# Altium project PWR_MNG.PRJPCB
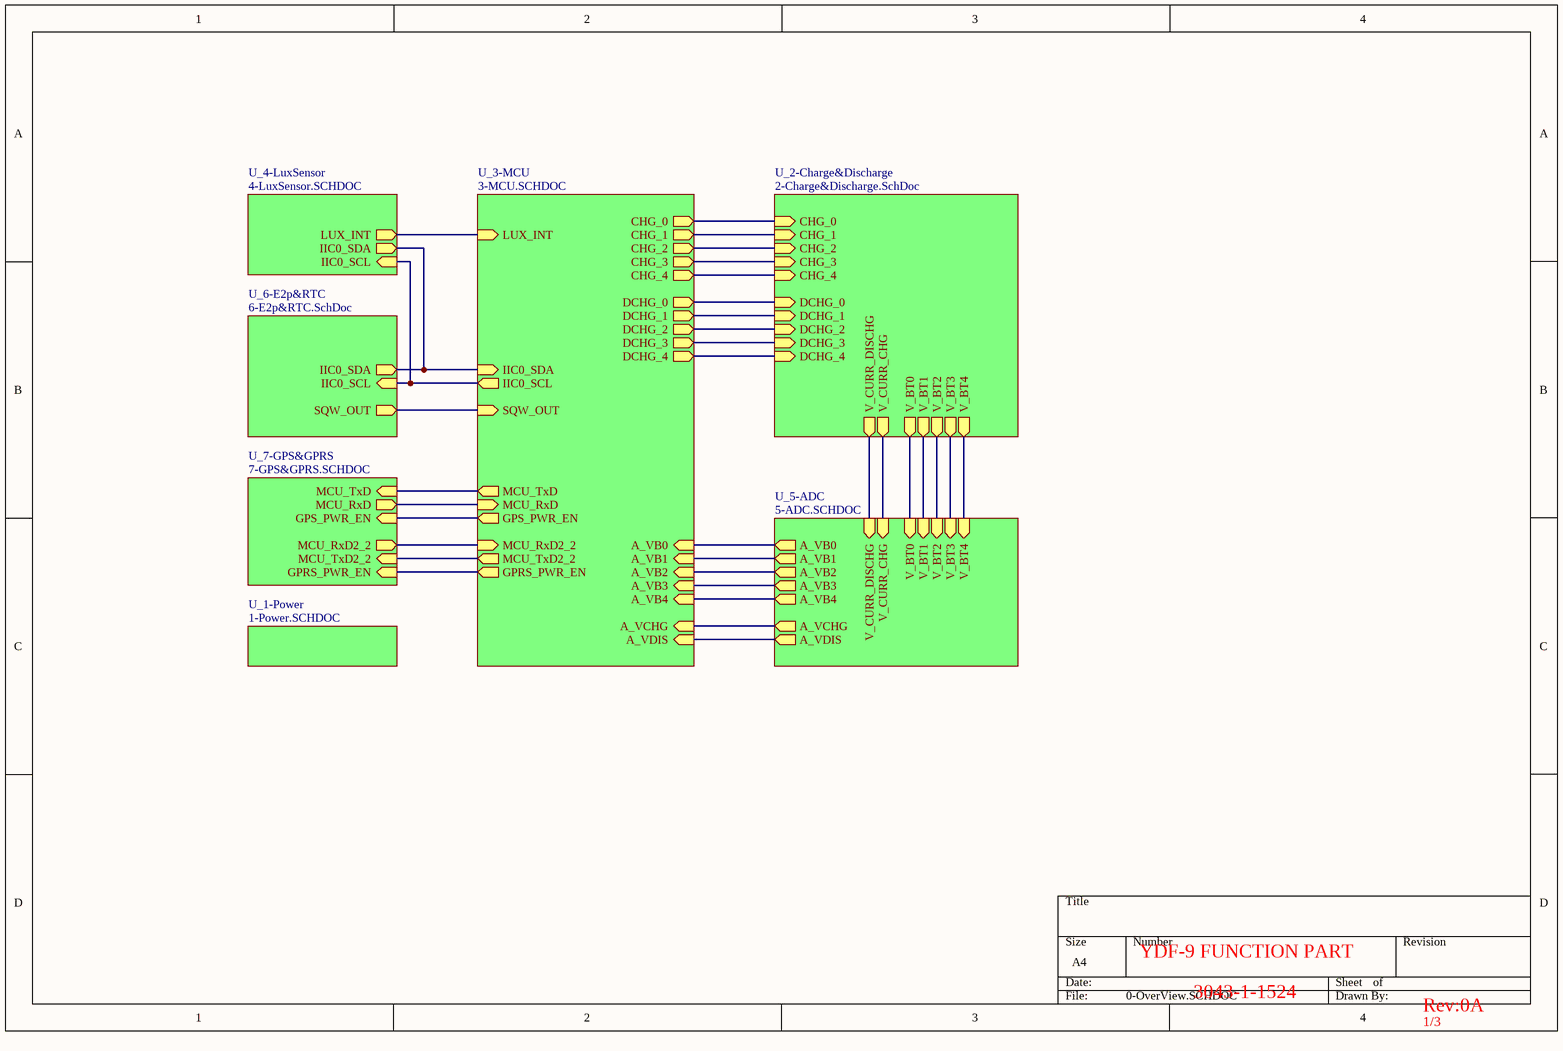
[diagram p0: 0-OverView.SCHDOC]
.TITLE: aaaaa
8 sheets, 98 parts. Net scope: hierarchical (ports join the sheet entries above them; power ports are global).
Board file: 3043-1-1532.PcbDoc
Sheets:
  0-OverView.SCHDOC
    U_2-Charge&Discharge = 2-Charge&Discharge.SchDoc
    U_1-Power = 1-Power.SCHDOC
    U_3-MCU = 3-MCU.SCHDOC
    U_5-ADC = 5-ADC.SCHDOC
    U_6-E2p&RTC = 6-E2p&RTC.SchDoc
    U_4-LuxSensor = 4-LuxSensor.SCHDOC
    U_7-GPS&GPRS = 7-GPS&GPRS.SCHDOC

## Sheet 0-OverView.SCHDOC
size A4

### Sub-sheets
U_1-Power = 1-Power.SCHDOC: no entries
U_2-Charge&Discharge = 2-Charge&Discharge.SchDoc: V_BT1 (out), V_BT2 (out), V_BT3 (out), V_BT4 (out), V_CURR_CHG (out), V_CURR_DISCHG (out), CHG_2 (in), CHG_3 (in), DCHG_0 (in), CHG_4 (in), CHG_0 (in), DCHG_1 (in), CHG_1 (in), DCHG_2 (in), DCHG_3 (in), V_BT0 (out), DCHG_4 (in)
U_3-MCU = 3-MCU.SCHDOC: IIC0_SDA (in), IIC0_SCL (out), SQW_OUT (in), A_VDIS (in), A_VCHG (in), A_VB1 (in), A_VB4 (in), A_VB2 (in), A_VB3 (in), GPRS_PWR_EN (out), MCU_RxD2_2 (in), GPS_PWR_EN (out), MCU_TxD2_2 (out), MCU_RxD (in), CHG_3 (out), CHG_4 (out), CHG_0 (out), CHG_1 (out), CHG_2 (out), DCHG_0 (out), DCHG_1 (out), DCHG_2 (out), DCHG_3 (out), LUX_INT (in), MCU_TxD (out), A_VB0 (in), DCHG_4 (out)
U_4-LuxSensor = 4-LuxSensor.SCHDOC: IIC0_SCL (in), IIC0_SDA (out), LUX_INT (out)
U_5-ADC = 5-ADC.SCHDOC: V_BT3 (in), V_BT2 (in), V_BT4 (in), V_BT1 (in), A_VDIS (out), A_VB3 (out), A_VB1 (out), A_VB4 (out), A_VCHG (out), A_VB2 (out), V_CURR_DISCHG (in), V_CURR_CHG (in), V_BT0 (in), A_VB0 (out)
U_6-E2p&RTC = 6-E2p&RTC.SchDoc: IIC0_SCL (in), IIC0_SDA (out), SQW_OUT (out)
U_7-GPS&GPRS = 7-GPS&GPRS.SCHDOC: GPS_PWR_EN (in), MCU_RxD (out), MCU_TxD2_2 (in), GPRS_PWR_EN (in), MCU_RxD2_2 (out), MCU_TxD (in)

### Nets
A_VB0: sheet U_3-MCU/A_VB0, sheet U_5-ADC/A_VB0
A_VB1: sheet U_3-MCU/A_VB1, sheet U_5-ADC/A_VB1
A_VB2: sheet U_3-MCU/A_VB2, sheet U_5-ADC/A_VB2
A_VB3: sheet U_3-MCU/A_VB3, sheet U_5-ADC/A_VB3
A_VB4: sheet U_3-MCU/A_VB4, sheet U_5-ADC/A_VB4
A_VCHG: sheet U_2-Charge&Discharge/V_CURR_CHG, sheet U_3-MCU/A_VCHG, sheet U_5-ADC/A_VCHG, sheet U_5-ADC/V_CURR_CHG
A_VDIS: sheet U_2-Charge&Discharge/V_CURR_DISCHG, sheet U_3-MCU/A_VDIS, sheet U_5-ADC/A_VDIS, sheet U_5-ADC/V_CURR_DISCHG
CHG_0: sheet U_2-Charge&Discharge/CHG_0, sheet U_3-MCU/CHG_0
CHG_1: sheet U_2-Charge&Discharge/CHG_1, sheet U_3-MCU/CHG_1
CHG_2: sheet U_2-Charge&Discharge/CHG_2, sheet U_3-MCU/CHG_2
CHG_3: sheet U_2-Charge&Discharge/CHG_3, sheet U_3-MCU/CHG_3
CHG_4: sheet U_2-Charge&Discharge/CHG_4, sheet U_3-MCU/CHG_4
DCHG_0: sheet U_2-Charge&Discharge/DCHG_0, sheet U_3-MCU/DCHG_0
DCHG_1: sheet U_2-Charge&Discharge/DCHG_1, sheet U_3-MCU/DCHG_1
DCHG_2: sheet U_2-Charge&Discharge/DCHG_2, sheet U_3-MCU/DCHG_2
DCHG_3: sheet U_2-Charge&Discharge/DCHG_3, sheet U_3-MCU/DCHG_3
DCHG_4: sheet U_2-Charge&Discharge/DCHG_4, sheet U_3-MCU/DCHG_4
GPRS_PWR_EN: sheet U_3-MCU/GPRS_PWR_EN, sheet U_7-GPS&GPRS/GPRS_PWR_EN
GPS_PWR_EN: sheet U_3-MCU/GPS_PWR_EN, sheet U_7-GPS&GPRS/GPS_PWR_EN
IIC0_SCL: sheet U_3-MCU/IIC0_SCL, sheet U_6-E2p&RTC/IIC0_SCL, sheet U_4-LuxSensor/IIC0_SCL
IIC0_SDA: sheet U_3-MCU/IIC0_SDA, sheet U_6-E2p&RTC/IIC0_SDA, sheet U_4-LuxSensor/IIC0_SDA
LUX_INT: sheet U_3-MCU/LUX_INT, sheet U_4-LuxSensor/LUX_INT
MCU_RxD: sheet U_3-MCU/MCU_RxD, sheet U_7-GPS&GPRS/MCU_RxD
MCU_RxD2_2: sheet U_3-MCU/MCU_RxD2_2, sheet U_7-GPS&GPRS/MCU_RxD2_2
MCU_TxD: sheet U_3-MCU/MCU_TxD, sheet U_7-GPS&GPRS/MCU_TxD
MCU_TxD2_2: sheet U_3-MCU/MCU_TxD2_2, sheet U_7-GPS&GPRS/MCU_TxD2_2
SQW_OUT: sheet U_3-MCU/SQW_OUT, sheet U_6-E2p&RTC/SQW_OUT
V_BT0: sheet U_2-Charge&Discharge/V_BT0, sheet U_5-ADC/V_BT0
V_BT1: sheet U_2-Charge&Discharge/V_BT1, sheet U_5-ADC/V_BT1
V_BT2: sheet U_2-Charge&Discharge/V_BT2, sheet U_5-ADC/V_BT2
V_BT3: sheet U_2-Charge&Discharge/V_BT3, sheet U_5-ADC/V_BT3
V_BT4: sheet U_2-Charge&Discharge/V_BT4, sheet U_5-ADC/V_BT4

### Notes on the sheet
- YDF-9 FUNCTION PART
- 3043-1-1524
- Rev:0A
- 1/3

## Sheet 2-Charge&Discharge.SchDoc
size A4
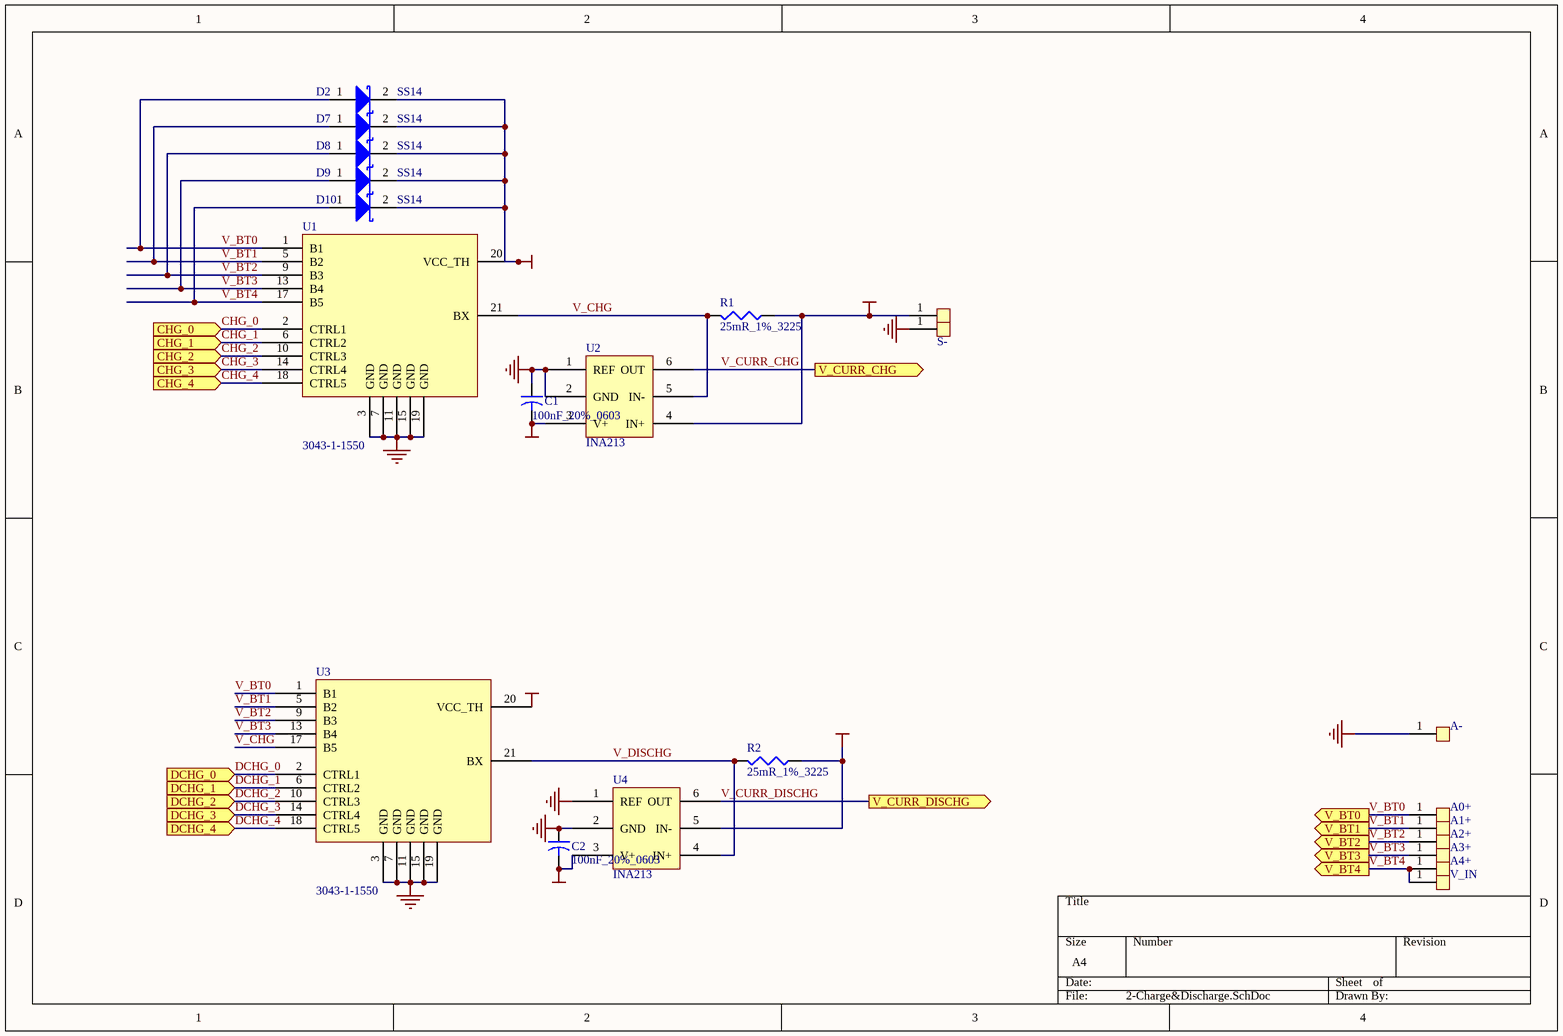
[diagram p1: 2-Charge&Discharge.SchDoc]

### Parts
A0+  ND  [END_1.5_2.8]  (value not drawn)
A1+  ND  [END_1.5_2.8]  (value not drawn)
A2+  ND  [END_1.5_2.8]  (value not drawn)
A3+  ND  [END_1.5_2.8]  (value not drawn)
A4+  ND  [END_1.5_2.8]  (value not drawn)
A-  ND  [END_1.5_2.8]  (value not drawn)
C1  100nF_20%_0603  [C1608-0603]
C2  100nF_20%_0603  [C1608-0603]
D2  SS14  [LED0805]
D7  SS14  [LED0805]
D8  SS14  [LED0805]
D9  SS14  [LED0805]
D10  SS14  [LED0805]
R1  25mR_1%_3225  [CR6332-2512]
R2  25mR_1%_3225  [CR6332-2512]
S+  ND  [END_1.5_2.8]  (value not drawn)
S-  ND  [END_1.5_2.8]  (value not drawn)
U1  3043-1-1550  [3043-1-1550V1.00]
U2  INA213  [SC70-6]
U3  3043-1-1550  [3043-1-1550V1.00]
U4  INA213  [SC70-6]
V_IN  ND  [END_3_6]  (value not drawn)

### Ports
CHG_0 (in), CHG_1 (in), CHG_2 (in), CHG_3 (in), CHG_4 (in), DCHG_0 (in), DCHG_1 (in), DCHG_2 (in), DCHG_3 (in), DCHG_4 (in), V_BT0 (out), V_BT1 (out), V_BT2 (out), V_BT3 (out), V_BT4 (out), V_CURR_CHG (out), V_CURR_DISCHG (out)

### Nets
GND: A-.1(SW) C1.1 C2.1 S-.1(SW) U1.3(GND) U1.7(GND) U1.11(GND) U1.15(GND) U1.19(GND) U2.1(REF) U2.2(GND) U3.3(GND) U3.7(GND) U3.11(GND) U3.15(GND) U3.19(GND) U4.1(REF) U4.2(GND)
VCC_2V8: C1.2 C2.2 U2.3(V+) U4.3(V+)
VCC_BAT: R2.1 U4.5(IN-)
VCC_CHARGE: R1.1 S+.1(SW) U2.4(IN+)
VCC_TH: D2.2(K) D7.2(K) D8.2(K) D9.2(K) D10.2(K) U1.20(VCC_TH) U3.20(VCC_TH)
CHG_0: U1.2(CTRL1) ; port CHG_0
CHG_1: U1.6(CTRL2) ; port CHG_1
CHG_2: U1.10(CTRL3) ; port CHG_2
CHG_3: U1.14(CTRL4) ; port CHG_3
CHG_4: U1.18(CTRL5) ; port CHG_4
DCHG_0: U3.2(CTRL1) ; port DCHG_0
DCHG_1: U3.6(CTRL2) ; port DCHG_1
DCHG_2: U3.10(CTRL3) ; port DCHG_2
DCHG_3: U3.14(CTRL4) ; port DCHG_3
DCHG_4: U3.18(CTRL5) ; port DCHG_4
V_BT0: A0+.1(SW) D2.1(A) U1.1(B1) U3.1(B1) ; port V_BT0
V_BT1: A1+.1(SW) D7.1(A) U1.5(B2) U3.5(B2) ; port V_BT1
V_BT2: A2+.1(SW) D8.1(A) U1.9(B3) U3.9(B3) ; port V_BT2
V_BT3: A3+.1(SW) D9.1(A) U1.13(B4) U3.13(B4) ; port V_BT3
V_BT4: A4+.1(SW) D10.1(A) U1.17(B5) V_IN.1(SW) ; port V_BT4
V_CHG: R1.2 U1.21(BX) U2.5(IN-) U3.17(B5)
V_CURR_CHG: U2.6(OUT) ; port V_CURR_CHG  [project net A_VCHG]
V_CURR_DISCHG: U4.6(OUT) ; port V_CURR_DISCHG  [project net A_VDIS]
V_DISCHG: R2.2 U3.21(BX) U4.4(IN+)

### Library data of the parts
C1 C2 = Cap2: Capacitor; Value: 0.1uF 20% 0603; Published: 23-Sep-2002; Publisher: Altium Limited
D2 D7-D10 = D Schottky: Schottky Diode; Code - JEDEC: DO-214-AA; Published: 8-Jun-2000; Revision: July-2002: Re-released for DXP Platform.; Publisher: Altium Limited
R1 R2 = Res3: Resistor; Value: 150R %5 0603; Published: 8-Jun-2000; Revision: July-2002: Re-released for DXP Platform.; Publisher: Altium Limited

## Sheet 1-Power.SCHDOC
size A4
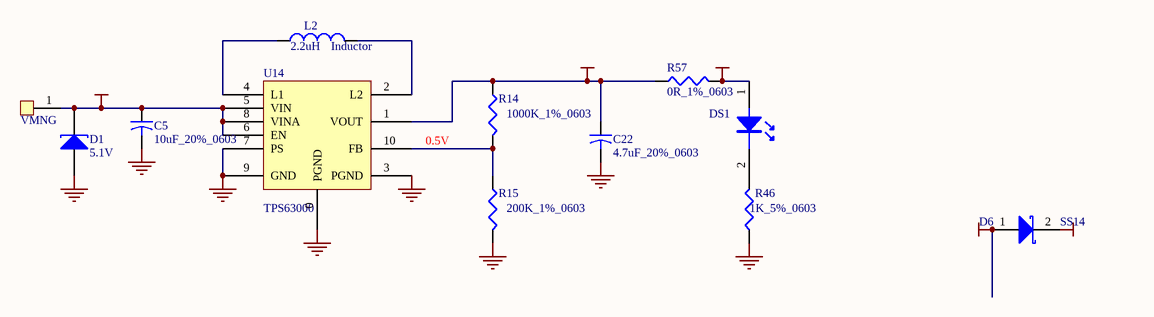
[diagram p2: 1-Power.SCHDOC]

### Parts
C5  10uF_20%_0603  [C1608-0603]
C22  4.7uF_20%_0603  [C1608-0603]
D1  5.1V  [LED0805]
D6  SS14  [LED0805]
DS1  LED  [LED0805]  (value not drawn)
L2  Inductor  value 2.2uH  [L3x3x1.5_5A]
R14  1000K_1%_0603  [C1608-0603]
R15  200K_1%_0603  [C1608-0603]
R46  1K_5%_0603  [C1608-0603]
R57  0R_1%_0603  [C1608-0603]
U14  TPS63000  [QFN-10]
VMNG  ND  [END_3_6]  (value not drawn)

### Nets
GND: C5.2 C22.2 D1.1(A) R15.2 R46.1 U14.0(PGND) U14.3(PGND) U14.7(PS) U14.9(GND)
VCC_2V8: D6.1(A) DS1.1 R57.2
VCC_MNG: C5.1 D1.2(K) U14.5(VIN) U14.6(EN) U14.8(VINA) VMNG.1(SW)
VCC_OUT: C22.1 R14.1 R57.1 U14.1(VOUT)
VCC_TH: D6.2(K)
NetDS1_2: DS1.2 R46.2
NetL2_1: L2.1 U14.4(L1)
NetL2_2: L2.2 U14.2(L2)
NetR14_2: R14.2 R15.1 U14.10(FB)

### Notes on the sheet
- 0.5V

### Library data of the parts
C5 C22 = Cap2: Capacitor; Value: 0.1uF 20% 0603; Published: 23-Sep-2002; Publisher: Altium Limited
D1 = D Tunnel1: Tunnel Diode - RLC Model; Published: 8-Jun-2000; LatestRevisionDate: 17-Jul-2002; LatestRevisionNote: Re-released for DXP Platform.; Publisher: Altium Limited
D6 = D Schottky: Schottky Diode; Code - JEDEC: DO-214-AA; Published: 8-Jun-2000; Revision: July-2002: Re-released for DXP Platform.; Publisher: Altium Limited
R14 R15 R57 = Res3: Resistor; Value: 1K%5 0603; Published: 8-Jun-2000; Revision: July-2002: Re-released for DXP Platform.; Publisher: Altium Limited
R46 = Res3: Resistor; Value: 1K; Published: 8-Jun-2000; Revision: July-2002: Re-released for DXP Platform.; Publisher: Altium Limited
L2 = Inductor: Published: 8-Jun-2000; Revision: July-2002: Re-released for DXP Platform.; Publisher: Altium Limited

## Sheet 3-MCU.SCHDOC
size A4
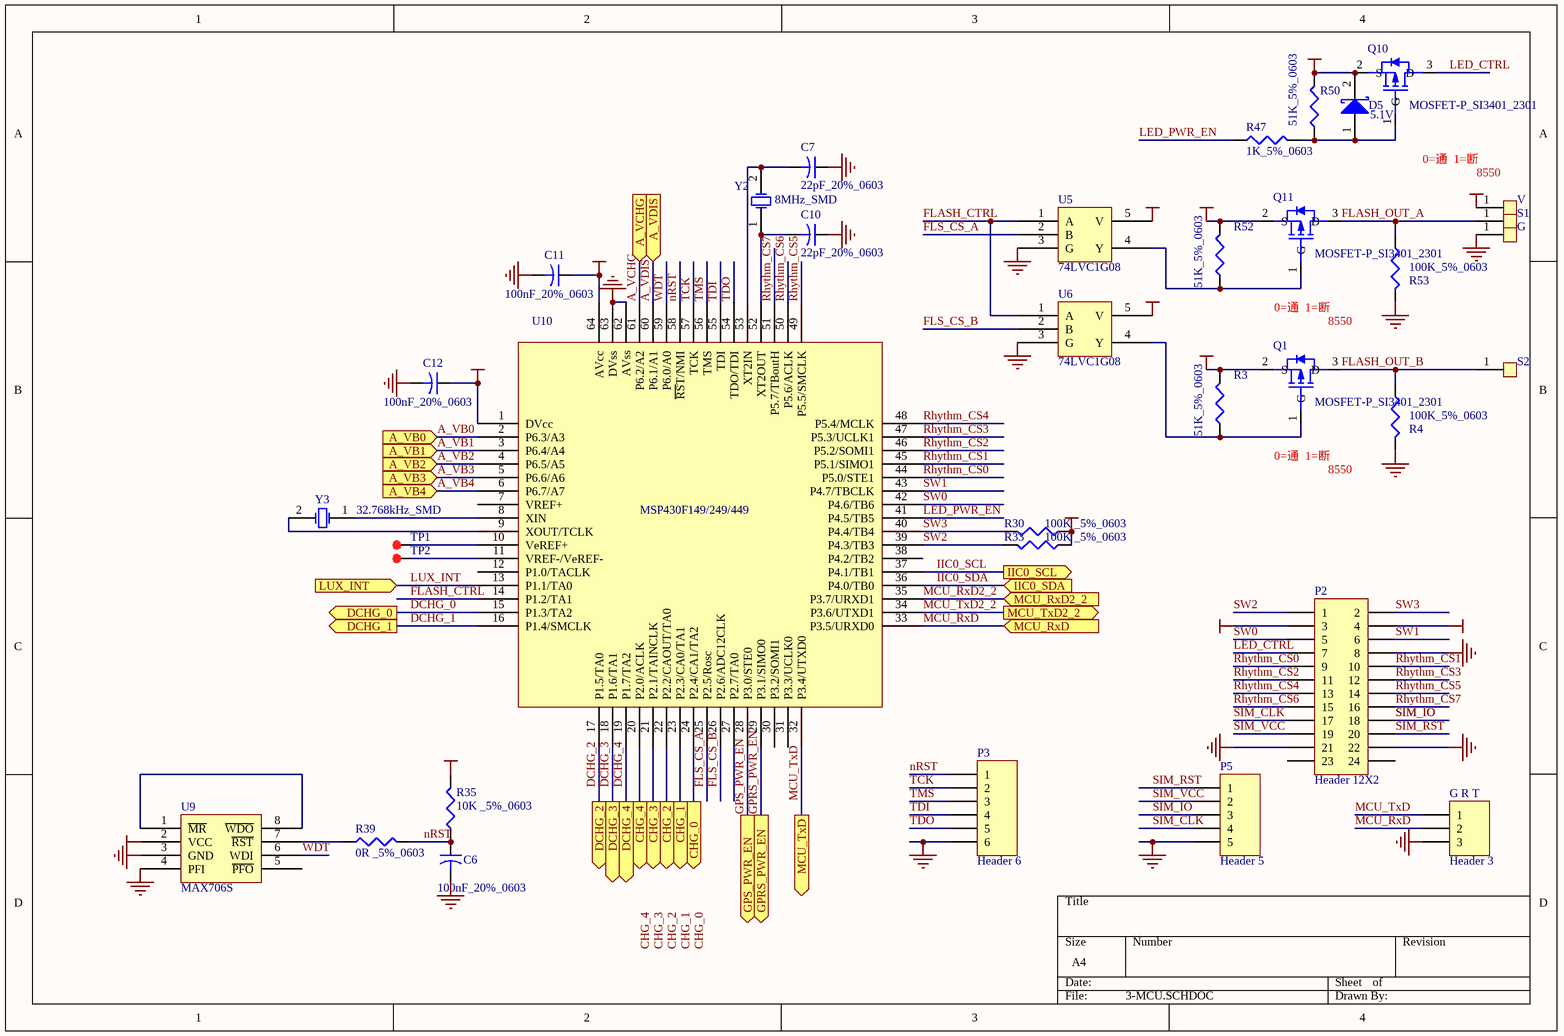
[diagram p3: 3-MCU.SCHDOC]

### Parts
C6  100nF_20%_0603  [C1608-0603]
C7  22pF_20%_0603  [C1608-0603]
C10  22pF_20%_0603  [C1608-0603]
C11  100nF_20%_0603  [C1608-0603]
C12  100nF_20%_0603  [C1608-0603]
D5  5.1V  [LED0805]
G  ND  [END_1.5_2.8]  (value not drawn)
G_R_T  Header 3  [XH-03H]
P2  Header 12X2  [HDR2X12]
P3  Header 6  [SH-06S]
P5  Header 5  [HDR1X5]
Q1  MOSFET-P_SI3401_2301  [SO-G3/C2.5]
Q10  MOSFET-P_SI3401_2301  [SO-G3/C2.5]
Q11  MOSFET-P_SI3401_2301  [SO-G3/C2.5]
R3  51K_5%_0603  [C1608-0603]
R4  100K_5%_0603  [C1608-0603]
R30  100K _5%_0603  [C1608-0603]
R33  100K _5%_0603  [C1608-0603]
R35  10K _5%_0603  [C1608-0603]
R39  0R _5%_0603  [C1608-0603]
R47  1K_5%_0603  [C1608-0603]
R50  51K_5%_0603  [C1608-0603]
R52  51K_5%_0603  [C1608-0603]
R53  100K_5%_0603  [C1608-0603]
S1  ND  [END_1.5_2.8]  (value not drawn)
S2  ND  [END_1.5_2.8]  (value not drawn)
TP1  TP  [TP_1MM]  (value not drawn)
TP2  TP  [TP_1MM]  (value not drawn)
U5  74LVC1G08  [SOT23-5]
U6  74LVC1G08  [SOT23-5]
U9  MAX706S  [SO-8]
U10  MSP430F149/249/449  [QFP-64]
V  ND  [END_1.5_2.8]  (value not drawn)
Y2  8MHz_SMD  [XTAL-P4mm_SMD]
Y3  32.768kHz_SMD  [XTAL-3216]

### Ports
A_VB0 (in), A_VB1 (in), A_VB2 (in), A_VB3 (in), A_VB4 (in), A_VCHG (in), A_VDIS (in), CHG_0 (out), CHG_1 (out), CHG_2 (out), CHG_3 (out), CHG_4 (out), DCHG_0 (out), DCHG_1 (out), DCHG_2 (out), DCHG_3 (out), DCHG_4 (out), GPRS_PWR_EN (out), GPS_PWR_EN (out), IIC0_SCL (out), IIC0_SDA (in), LUX_INT (in), MCU_RxD2_2 (in), MCU_RxD (in), MCU_TxD2_2 (out), MCU_TxD (out)

### Nets
GND: C6.2 C7.1 C10.1 C11.2 C12.2 G.1(SW) G_R_T.3 P2.8 P2.21 P2.22 P3.6 P5.5 R4.2 R53.2 U5.3(G) U6.3(G) U9.3(GND) U9.4(PFI) U10.62(AVss) U10.63(DVss)
VCC_2V8: C11.1 C12.1 D5.2(K) P2.3 P2.4 Q1.2(S) Q10.2(S) Q11.2(S) R3.2 R30.1 R33.1 R35.2 R50.2 R52.2 U5.5(V) U6.5(V) U9.2(VCC) U10.1(DVcc) U10.64(AVcc)
VCC_BAT: V.1(SW)
A_VB0: U10.2(P6.3/A3) ; port A_VB0
A_VB1: U10.3(P6.4/A4) ; port A_VB1
A_VB2: U10.4(P6.5/A5) ; port A_VB2
A_VB3: U10.5(P6.6/A6) ; port A_VB3
A_VB4: U10.6(P6.7/A7) ; port A_VB4
A_VCHG: U10.61(P6.2/A2) ; port A_VCHG
A_VDIS: U10.60(P6.1/A1) ; port A_VDIS
CHG_0: U10.24(P2.4/CA1/TA2) ; port CHG_0
CHG_1: U10.23(P2.3/CA0/TA1) ; port CHG_1
CHG_2: U10.22(P2.2/CAOUT/TA0) ; port CHG_2
CHG_3: U10.21(P2.1/TAINCLK) ; port CHG_3
CHG_4: U10.20(P2.0/ACLK) ; port CHG_4
DCHG_0: U10.15(P1.3/TA2) ; port DCHG_0
DCHG_1: U10.16(P1.4/SMCLK) ; port DCHG_1
DCHG_2: U10.17(P1.5/TA0) ; port DCHG_2
DCHG_3: U10.18(P1.6/TA1) ; port DCHG_3
DCHG_4: U10.19(P1.7/TA2) ; port DCHG_4
FLASH_CTRL: U5.1(A) U6.1(A) U10.14(P1.2/TA1)
FLASH_OUT_A: Q11.3(D) R53.1 S1.1(SW)
FLASH_OUT_B: Q1.3(D) R4.1 S2.1(SW)
FLS_CS_A: U5.2(B) U10.25(P2.5/Rosc)
FLS_CS_B: U6.2(B) U10.26(P2.6/ADC12CLK)
GPRS_PWR_EN: U10.29(P3.1/SIMO0) ; port GPRS_PWR_EN
GPS_PWR_EN: U10.28(P3.0/STE0) ; port GPS_PWR_EN
IIC0_SCL: U10.37(P4.1/TB1) ; port IIC0_SCL
IIC0_SDA: U10.36(P4.0/TB0) ; port IIC0_SDA
LED_CTRL: P2.7 Q10.3(D)
LED_PWR_EN: R47.1 U10.41(P4.5/TB5)
LUX_INT: U10.13(P1.1/TA0) ; port LUX_INT
MCU_RxD: G_R_T.2 U10.33(P3.5/URXD0) ; port MCU_RxD
MCU_RxD2_2: U10.35(P3.7/URXD1) ; port MCU_RxD2_2
MCU_TxD: G_R_T.1 U10.32(P3.4/UTXD0) ; port MCU_TxD
MCU_TxD2_2: U10.34(P3.6/UTXD1) ; port MCU_TxD2_2
nRST: C6.1 P3.1 R35.1 R39.2 U10.58(~{RS}T/NMI)
Rhythm_CS0: P2.9 U10.44(P5.0/STE1)
Rhythm_CS1: P2.10 U10.45(P5.1/SIMO1)
Rhythm_CS2: P2.11 U10.46(P5.2/SOMI1)
Rhythm_CS3: P2.12 U10.47(P5.3/UCLK1)
Rhythm_CS4: P2.13 U10.48(P5.4/MCLK)
Rhythm_CS5: P2.14 U10.49(P5.5/SMCLK)
Rhythm_CS6: P2.15 U10.50(P5.6/ACLK)
Rhythm_CS7: P2.16 U10.51(P5.7/TBoutH)
SIM_CLK: P2.17 P5.4
SIM_IO: P2.18 P5.3
SIM_RST: P2.20 P5.1
SIM_VCC: P2.19 P5.2
SW0: P2.5 U10.42(P4.6/TB6)
SW1: P2.6 U10.43(P4.7/TBCLK)
SW2: P2.1 R33.2 U10.39(P4.3/TB3)
SW3: P2.2 R30.2 U10.40(P4.4/TB4)
TCK: P3.2 U10.57(TCK)
TDI: P3.4 U10.55(TDI)
TDO: P3.5 U10.54(TDO/TDI)
TMS: P3.3 U10.56(TMS)
WDT: U9.6(WDI) U10.59(P6.0/A0)
NetC7_2: C7.2 U10.53(XT2IN) Y2.2(OSC2)
NetC10_2: C10.2 U10.52(XT2OUT) Y2.1(OSC1)
NetD5_1: D5.1(A) Q10.1(G) R47.2 R50.1
NetQ1_1: Q1.1(G) R3.1 U6.4(Y)
NetQ11_1: Q11.1(G) R52.1 U5.4(Y)
NetR39_1: R39.1 U9.7(~{RST})
NetTP1_1: TP1.1(TP) U10.10(VeREF+)
NetTP2_1: TP2.1(TP) U10.11(VREF-/VeREF-)
NetU9_1: U9.1(~{MR}) U9.8(~{WDO})
NetU10_8: U10.8(XIN) Y3.1(OSC1)
NetU10_9: U10.9(XOUT/TCLK) Y3.2(OSC2)

Not connected (* = marked no-connect by the designer): P2 23 24; U9 5(~{PFO}); U10 7(VREF+) 12(P1.0/TACLK) 27(P2.7/TA0) 30(P3.2/SOMI1) 31(P3.3/UCLK0) 38(P4.2/TB2)

### Notes on the sheet
- 0=通  1=断
- 8550
- Labels drawn without touching a wire or pin: CHG_0, CHG_1, CHG_2, CHG_3, CHG_4

### Library data of the parts
C6 = Cap2: Capacitor; Value: 0.1uF 0603; Published: 23-Sep-2002; Publisher: Altium Limited
C7 C10-C12 = Cap2: Capacitor; Value: 0.1uF 20% 0603; Published: 23-Sep-2002; Publisher: Altium Limited
D5 = D Schottky: Schottky Diode; Code - JEDEC: DO-214-AA; Published: 8-Jun-2000; Revision: July-2002: Re-released for DXP Platform.; Publisher: Altium Limited
G_R_T = Header 3: Header, 3-Pin; LatestRevisionDate: 17-Jul-2002; LatestRevisionNote: Re-released for DXP Platform.; Publisher: Altium Limited
P2 = Header 12X2: Header, 12-Pin, Dual row; LatestRevisionDate: 17-Jul-2002; LatestRevisionNote: Re-released for DXP Platform.; Publisher: Altium Limited
P3 = Header 6: Header, 6-Pin; LatestRevisionDate: 17-Jul-2002; LatestRevisionNote: Re-released for DXP Platform.; Publisher: Altium Limited
P5 = Header 5: Header, 5-Pin; LatestRevisionDate: 17-Jul-2002; LatestRevisionNote: Re-released for DXP Platform.; Publisher: Altium Limited
Q1 Q10 Q11 = MOSFET-P
R3 R4 R50 R52 R53 = Res3: Resistor; Published: 8-Jun-2000; Revision: July-2002: Re-released for DXP Platform.; Publisher: Altium Limited
R30 R33 R35 R39 = Res3: Resistor; Value: 1M %5 0603_NC; Published: 8-Jun-2000; Revision: July-2002: Re-released for DXP Platform.; Publisher: Altium Limited
R47 = Res3: Resistor; Value: 1K%5 0603; Published: 8-Jun-2000; Revision: July-2002: Re-released for DXP Platform.; Publisher: Altium Limited
TP1 TP2 = TP_1mm
U9 = MAX706
Y2 Y3 = XTAL: Crystal Oscillator; Published: 8-Jun-2000; Revision: July-2002: Re-released for DXP Platform.; Publisher: Altium Limited

## Sheet 5-ADC.SCHDOC
size A4
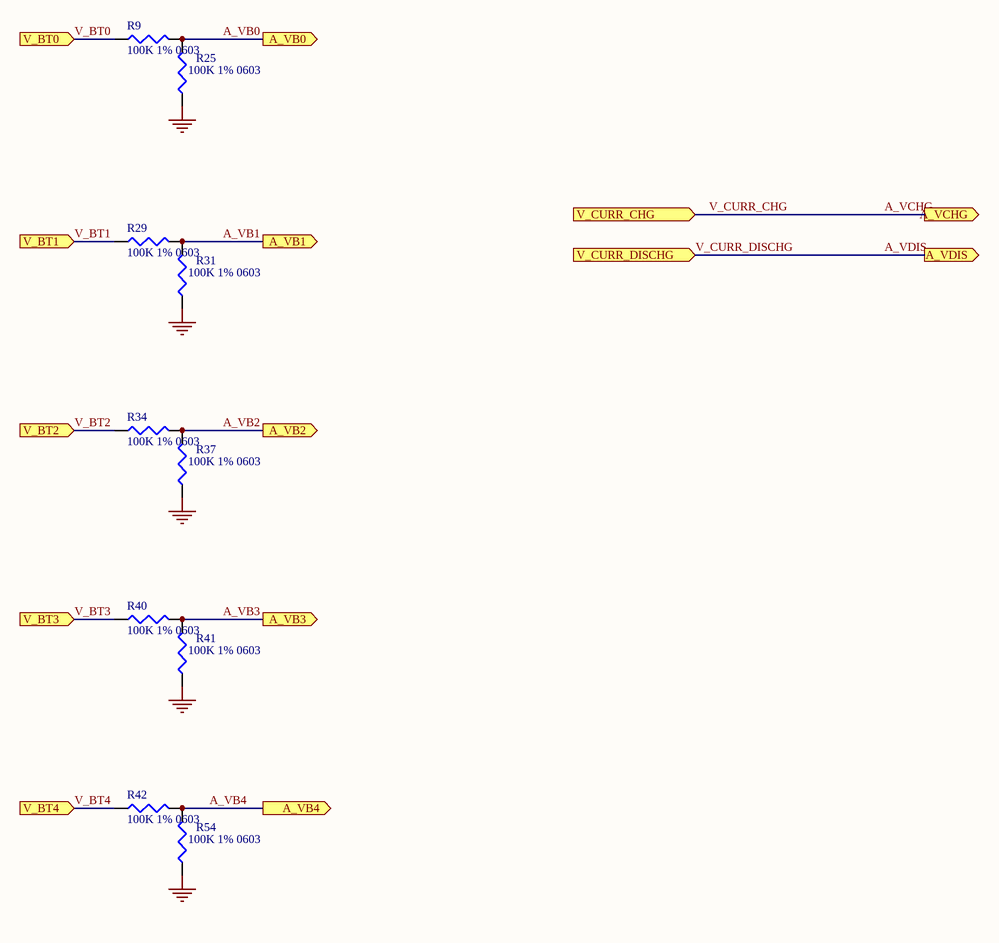
[diagram p4: 5-ADC.SCHDOC]

### Parts
R9  value 100K 1% 0603  [C1608-0603]  (hidden comment: 1K_5%_0603)
R25  value 100K 1% 0603  [C1608-0603]  (hidden comment: 1K_5%_0603)
R29  value 100K 1% 0603  [C1608-0603]  (hidden comment: 1K_5%_0603)
R31  value 100K 1% 0603  [C1608-0603]  (hidden comment: 1K_5%_0603)
R34  value 100K 1% 0603  [C1608-0603]  (hidden comment: 1K_5%_0603)
R37  value 100K 1% 0603  [C1608-0603]  (hidden comment: 1K_5%_0603)
R40  value 100K 1% 0603  [C1608-0603]  (hidden comment: 1K_5%_0603)
R41  value 100K 1% 0603  [C1608-0603]  (hidden comment: 1K_5%_0603)
R42  value 100K 1% 0603  [C1608-0603]  (hidden comment: 1K_5%_0603)
R54  value 100K 1% 0603  [C1608-0603]  (hidden comment: 1K_5%_0603)

### Ports
A_VB0 (out), A_VB1 (out), A_VB2 (out), A_VB3 (out), A_VB4 (out), A_VCHG (out), A_VDIS (out), V_BT0 (in), V_BT1 (in), V_BT2 (in), V_BT3 (in), V_BT4 (in), V_CURR_CHG (in), V_CURR_DISCHG (in)

### Nets
GND: R25.1 R31.1 R37.1 R41.1 R54.1
A_VB0: R9.2 R25.2 ; port A_VB0
A_VB1: R29.2 R31.2 ; port A_VB1
A_VB2: R34.2 R37.2 ; port A_VB2
A_VB3: R40.2 R41.2 ; port A_VB3
A_VB4: R42.2 R54.2 ; port A_VB4
A_VCHG: port A_VCHG, port V_CURR_CHG  [also labelled V_CURR_CHG]
A_VDIS: port A_VDIS, port V_CURR_DISCHG  [also labelled V_CURR_DISCHG]
V_BT0: R9.1 ; port V_BT0
V_BT1: R29.1 ; port V_BT1
V_BT2: R34.1 ; port V_BT2
V_BT3: R40.1 ; port V_BT3
V_BT4: R42.1 ; port V_BT4

### Library data of the parts
R9 R25 R29 R31 R34 R37 R40-R42 R54 = Res3: Resistor; Published: 8-Jun-2000; Revision: July-2002: Re-released for DXP Platform.; Publisher: Altium Limited

## Sheet 6-E2p&RTC.SchDoc
size A4
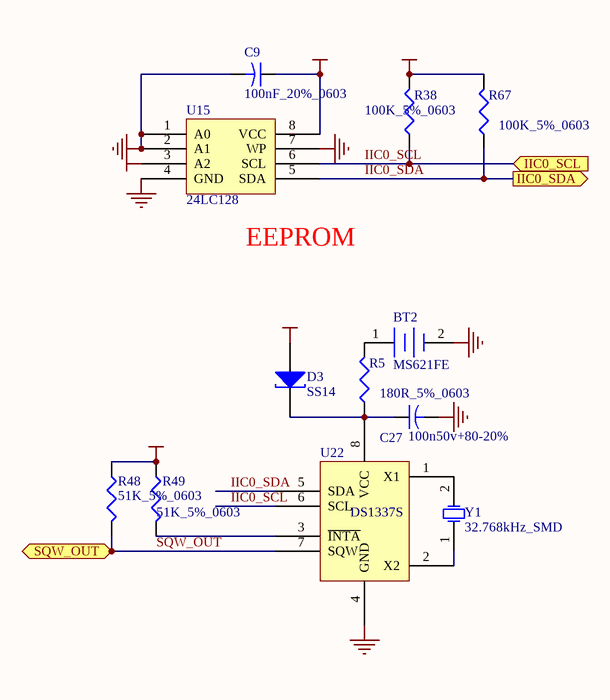
[diagram p5: 6-E2p&RTC.SchDoc]

### Parts
BT2  MS621FE  [BATT_BAK]
C9  100nF_20%_0603  [C1608-0603]
C27  value 100n50v+80-20%  [C1608-0603]  (hidden comment: Cap2)
D3  SS14  [LED0805]
R5  180R_5%_0603  [C1608-0603]
R38  100K_5%_0603  [C1608-0603]
R48  51K_5%_0603  [C1608-0603]
R49  51K_5%_0603  [C1608-0603]
R67  100K_5%_0603  [C1608-0603]
U15  24LC128  [8s1]
U22  DS1337S  [SO-8]
Y1  32.768kHz_SMD  [XTAL-3216]

### Ports
IIC0_SCL (in), IIC0_SDA (out), SQW_OUT (out)

### Nets
GND: BT2.2(-) C9.2 C27.2 U15.1(A0) U15.2(A1) U15.4(GND) U15.7(WP) U22.4(GND)
VCC_2V8: C9.1 D3.1(A) R38.2 R48.1 R49.1 R67.2 U15.3(A2) U15.8(VCC)
IIC0_SCL: R38.1 U15.6(SCL) U22.6(SCL) ; port IIC0_SCL
IIC0_SDA: R67.1 U15.5(SDA) U22.5(SDA) ; port IIC0_SDA
SQW_OUT: R48.2 U22.7(SQW) ; port SQW_OUT
NetBT2_1: BT2.1(+) R5.2
NetC27_1: C27.1 D3.2(K) R5.1 U22.8(VCC)
NetR49_2: R49.2 U22.3(~{INTA})
NetU22_1: U22.1(X1) Y1.2(OSC2)
NetU22_2: U22.2(X2) Y1.1(OSC1)

### Notes on the sheet
- (near U15) EEPROM

### Library data of the parts
BT2 = Battery: Multicell Battery; Published: 24-Mar-1999; Revision: July-2002: Re-released for DXP Platform.; Publisher: Altium Limited
C9 = Cap2: Capacitor; Value: 0.1uF 0603; Published: 23-Sep-2002; Publisher: Altium Limited
C27 = Cap2: Capacitor; Published: 23-Sep-2002; Publisher: Altium Limited
D3 = D Tunnel1: Tunnel Diode - RLC Model; Published: 8-Jun-2000; LatestRevisionDate: 17-Jul-2002; LatestRevisionNote: Re-released for DXP Platform.; Publisher: Altium Limited
R5 R38 R48 R49 R67 = Res3: Resistor; Value: 1K%5 0603; Published: 8-Jun-2000; Revision: July-2002: Re-released for DXP Platform.; Publisher: Altium Limited
U15 = 24LC02: IC
Y1 = XTAL: Crystal Oscillator; Published: 8-Jun-2000; Revision: July-2002: Re-released for DXP Platform.; Publisher: Altium Limited

## Sheet 4-LuxSensor.SCHDOC
size A4
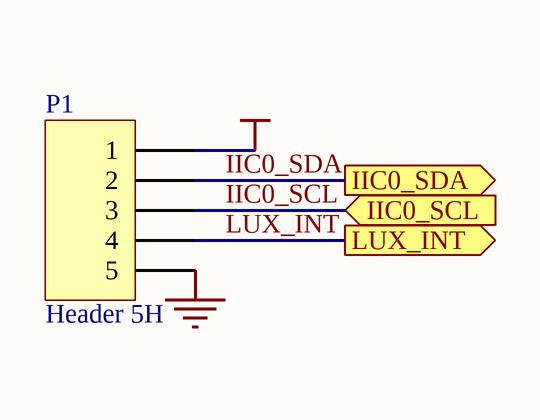
[diagram p6: 4-LuxSensor.SCHDOC]

### Parts
P1  Header 5H  [SH-06S]

### Ports
IIC0_SCL (in), IIC0_SDA (out), LUX_INT (out)

### Nets
GND: P1.5
VCC_2V8: P1.1
IIC0_SCL: P1.3 ; port IIC0_SCL
IIC0_SDA: P1.2 ; port IIC0_SDA
LUX_INT: P1.4 ; port LUX_INT

### Library data of the parts
P1 = Header 5H: Header, 5-Pin, Right Angle; LatestRevisionDate: 17-Jul-2002; LatestRevisionNote: Re-released for DXP Platform.; Publisher: Altium Limited

## Sheet 7-GPS&GPRS.SCHDOC
size A4
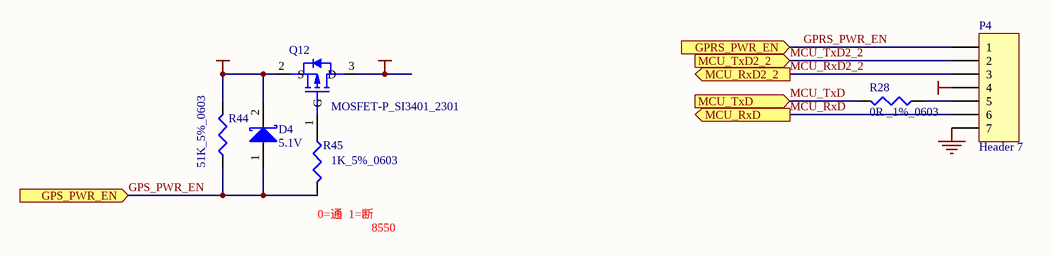
[diagram p7: 7-GPS&GPRS.SCHDOC]

### Parts
D4  5.1V  [LED0805]
P4  Header 7  [HDR1X7]
Q12  MOSFET-P_SI3401_2301  [SO-G3/C2.5]
R28  0R _1%_0603  [C1608-0603]
R44  51K_5%_0603  [C1608-0603]
R45  1K_5%_0603  [C1608-0603]

### Ports
GPRS_PWR_EN (in), GPS_PWR_EN (in), MCU_RxD2_2 (out), MCU_RxD (out), MCU_TxD2_2 (in), MCU_TxD (in)

### Nets
GND: P4.7
V_GPS: P4.4 Q12.3(D)
VCC_2V8: D4.2(K) Q12.2(S) R44.2
GPRS_PWR_EN: P4.1 ; port GPRS_PWR_EN
GPS_PWR_EN: D4.1(A) R44.1 R45.2 ; port GPS_PWR_EN
MCU_RxD: P4.6 ; port MCU_RxD
MCU_RxD2_2: P4.3 ; port MCU_RxD2_2
MCU_TxD: R28.2 ; port MCU_TxD
MCU_TxD2_2: P4.2 ; port MCU_TxD2_2
NetP4_5: P4.5 R28.1
NetQ12_1: Q12.1(G) R45.1

### Notes on the sheet
- (near R45) 0=通  1=断
- 8550

### Library data of the parts
D4 = D Schottky: Schottky Diode; Code - JEDEC: DO-214-AA; Published: 8-Jun-2000; Revision: July-2002: Re-released for DXP Platform.; Publisher: Altium Limited
P4 = Header 7: Header, 7-Pin; LatestRevisionDate: 17-Jul-2002; LatestRevisionNote: Re-released for DXP Platform.; Publisher: Altium Limited
Q12 = MOSFET-P
R28 = Res3: Resistor; Value: 1M %5 0603_NC; Published: 8-Jun-2000; Revision: July-2002: Re-released for DXP Platform.; Publisher: Altium Limited
R44 R45 = Res3: Resistor; Value: 1K%5 0603; Published: 8-Jun-2000; Revision: July-2002: Re-released for DXP Platform.; Publisher: Altium Limited

## Nets that join several sheets
GND: 2-Charge&Discharge (18 pins), 1-Power (9 pins), 3-MCU (20 pins), 5-ADC (5 pins), 6-E2p&RTC (8 pins), 4-LuxSensor (P1.5), 7-GPS&GPRS (P4.7)
VCC_2V8: 2-Charge&Discharge (C1.2 C2.2 U2.3 U4.3), 1-Power (D6.1 DS1.1 R57.2), 3-MCU (19 pins), 6-E2p&RTC (8 pins), 4-LuxSensor (P1.1), 7-GPS&GPRS (D4.2 Q12.2 R44.2)
VCC_BAT: 2-Charge&Discharge (R2.1 U4.5), 3-MCU (V.1)
VCC_TH: 2-Charge&Discharge (7 pins), 1-Power (D6.2)
A_VB0: 3-MCU (U10.2), 5-ADC (R9.2 R25.2)
A_VB1: 3-MCU (U10.3), 5-ADC (R29.2 R31.2)
A_VB2: 3-MCU (U10.4), 5-ADC (R34.2 R37.2)
A_VB3: 3-MCU (U10.5), 5-ADC (R40.2 R41.2)
A_VB4: 3-MCU (U10.6), 5-ADC (R42.2 R54.2)
A_VCHG: 2-Charge&Discharge (U2.6), 3-MCU (U10.61)
A_VDIS: 2-Charge&Discharge (U4.6), 3-MCU (U10.60)
CHG_0: 2-Charge&Discharge (U1.2), 3-MCU (U10.24)
CHG_1: 2-Charge&Discharge (U1.6), 3-MCU (U10.23)
CHG_2: 2-Charge&Discharge (U1.10), 3-MCU (U10.22)
CHG_3: 2-Charge&Discharge (U1.14), 3-MCU (U10.21)
CHG_4: 2-Charge&Discharge (U1.18), 3-MCU (U10.20)
DCHG_0: 2-Charge&Discharge (U3.2), 3-MCU (U10.15)
DCHG_1: 2-Charge&Discharge (U3.6), 3-MCU (U10.16)
DCHG_2: 2-Charge&Discharge (U3.10), 3-MCU (U10.17)
DCHG_3: 2-Charge&Discharge (U3.14), 3-MCU (U10.18)
DCHG_4: 2-Charge&Discharge (U3.18), 3-MCU (U10.19)
GPRS_PWR_EN: 3-MCU (U10.29), 7-GPS&GPRS (P4.1)
GPS_PWR_EN: 3-MCU (U10.28), 7-GPS&GPRS (D4.1 R44.1 R45.2)
IIC0_SCL: 3-MCU (U10.37), 6-E2p&RTC (R38.1 U15.6 U22.6), 4-LuxSensor (P1.3)
IIC0_SDA: 3-MCU (U10.36), 6-E2p&RTC (R67.1 U15.5 U22.5), 4-LuxSensor (P1.2)
LUX_INT: 3-MCU (U10.13), 4-LuxSensor (P1.4)
MCU_RxD: 3-MCU (G_R_T.2 U10.33), 7-GPS&GPRS (P4.6)
MCU_RxD2_2: 3-MCU (U10.35), 7-GPS&GPRS (P4.3)
MCU_TxD: 3-MCU (G_R_T.1 U10.32), 7-GPS&GPRS (R28.2)
MCU_TxD2_2: 3-MCU (U10.34), 7-GPS&GPRS (P4.2)
V_BT0: 2-Charge&Discharge (A0+.1 D2.1 U1.1 U3.1), 5-ADC (R9.1)
V_BT1: 2-Charge&Discharge (A1+.1 D7.1 U1.5 U3.5), 5-ADC (R29.1)
V_BT2: 2-Charge&Discharge (A2+.1 D8.1 U1.9 U3.9), 5-ADC (R34.1)
V_BT3: 2-Charge&Discharge (A3+.1 D9.1 U1.13 U3.13), 5-ADC (R40.1)
V_BT4: 2-Charge&Discharge (A4+.1 D10.1 U1.17 V_IN.1), 5-ADC (R42.1)